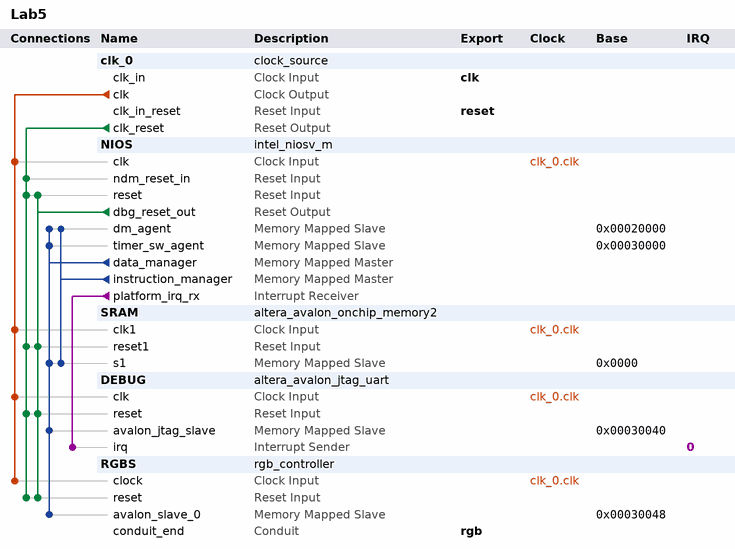
[diagram p0: system contents]
# Platform Designer (Qsys) system Lab5, Cyclone V 5CEBA2F17A7
# Parameters at their usual value, and those the tool derives, are not listed.
package require -exact qsys 25.1
create_system Lab5
set_project_property DEVICE_FAMILY {Cyclone V}
set_project_property DEVICE 5CEBA2F17A7

add_instance clk_0 clock_source 25.1
set_instance_parameter_value clk_0 clockFrequency 50000000

add_instance NIOS intel_niosv_m 26.0.0
set_instance_parameter_value NIOS enableAvalonInterface false
set_instance_parameter_value NIOS enableDebugReset true
set_instance_parameter_value NIOS enableECCFull false
set_instance_parameter_value NIOS enableECCLite false
set_instance_parameter_value NIOS hartId 0
set_instance_parameter_value NIOS interruptMode 0
set_instance_parameter_value NIOS pipelineArch true
set_instance_parameter_value NIOS resetSlave SRAM.s1

add_instance SRAM altera_avalon_onchip_memory2 25.1
set_instance_parameter_value SRAM dataWidth 32
set_instance_parameter_value SRAM dualPort false
set_instance_parameter_value SRAM initMemContent true
set_instance_parameter_value SRAM initializationFileName onchip_mem.hex
set_instance_parameter_value SRAM memorySize 131072

add_instance DEBUG altera_avalon_jtag_uart 25.1
set_instance_parameter_value DEBUG simInteractiveOptions NO_INTERACTIVE_WINDOWS

add_instance RGBS rgb_controller 1.0

# connections
add_connection clk_0.clk DEBUG.clk clock
add_connection clk_0.clk NIOS.clk clock
add_connection clk_0.clk RGBS.clock clock
add_connection clk_0.clk SRAM.clk1 clock
add_connection clk_0.clk_reset DEBUG.reset reset
add_connection clk_0.clk_reset NIOS.ndm_reset_in reset
add_connection clk_0.clk_reset NIOS.reset reset
add_connection clk_0.clk_reset RGBS.reset reset
add_connection clk_0.clk_reset SRAM.reset1 reset
add_connection NIOS.dbg_reset_out DEBUG.reset reset
add_connection NIOS.dbg_reset_out NIOS.reset reset
add_connection NIOS.dbg_reset_out RGBS.reset reset
add_connection NIOS.dbg_reset_out SRAM.reset1 reset
add_connection NIOS.data_manager DEBUG.avalon_jtag_slave avalon
set_connection_parameter_value NIOS.data_manager/DEBUG.avalon_jtag_slave baseAddress 0x00030040
add_connection NIOS.data_manager NIOS.dm_agent avalon
set_connection_parameter_value NIOS.data_manager/NIOS.dm_agent baseAddress 0x00020000
add_connection NIOS.data_manager NIOS.timer_sw_agent avalon
set_connection_parameter_value NIOS.data_manager/NIOS.timer_sw_agent baseAddress 0x00030000
add_connection NIOS.data_manager RGBS.avalon_slave_0 avalon
set_connection_parameter_value NIOS.data_manager/RGBS.avalon_slave_0 baseAddress 0x00030048
add_connection NIOS.data_manager SRAM.s1 avalon
set_connection_parameter_value NIOS.data_manager/SRAM.s1 baseAddress 0x0000
add_connection NIOS.instruction_manager NIOS.dm_agent avalon
set_connection_parameter_value NIOS.instruction_manager/NIOS.dm_agent baseAddress 0x00020000
add_connection NIOS.instruction_manager SRAM.s1 avalon
set_connection_parameter_value NIOS.instruction_manager/SRAM.s1 baseAddress 0x0000
add_connection NIOS.platform_irq_rx DEBUG.irq interrupt
set_connection_parameter_value NIOS.platform_irq_rx/DEBUG.irq irqNumber 0

# exported interfaces
add_interface clk clock sink
set_interface_property clk EXPORT_OF clk_0.clk_in
add_interface reset reset sink
set_interface_property reset EXPORT_OF clk_0.clk_in_reset
add_interface rgb conduit end
set_interface_property rgb EXPORT_OF RGBS.conduit_end

set_interconnect_requirement {$system} qsys_mm.clockCrossingAdapter HANDSHAKE
set_interconnect_requirement {$system} qsys_mm.enableEccProtection FALSE
set_interconnect_requirement {$system} qsys_mm.insertDefaultSlave FALSE
set_interconnect_requirement {$system} qsys_mm.maxAdditionalLatency 1

save_system Lab5.qsys
